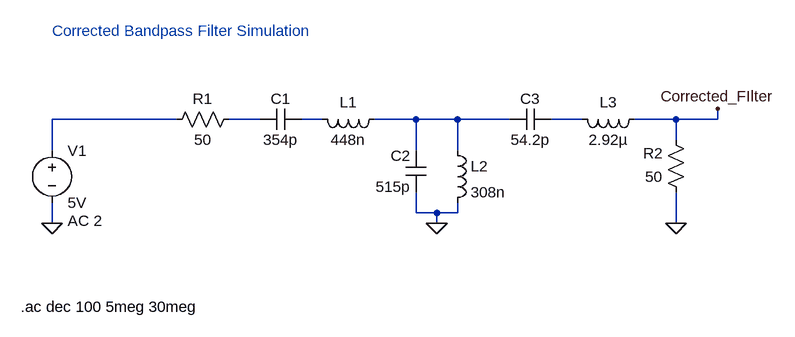
[diagram p0: schematic CorrectedBandPassSimulation.asc]
CorrectedBandPassSimulation.asc, the LTspice schematic file:
Version 4
SHEET 1 1152 680
WIRE 208 64 16 64
WIRE 336 64 288 64
WIRE 432 64 400 64
WIRE 576 64 512 64
WIRE 640 64 576 64
WIRE 720 64 640 64
WIRE 832 64 784 64
WIRE 976 64 912 64
WIRE 1040 64 1040 48
WIRE 1040 64 976 64
WIRE 976 96 976 64
WIRE 16 112 16 64
WIRE 576 112 576 64
WIRE 640 112 640 64
WIRE 576 208 576 176
WIRE 608 208 576 208
WIRE 640 208 640 192
WIRE 640 208 608 208
WIRE 16 224 16 192
WIRE 608 224 608 208
WIRE 976 224 976 176
FLAG 16 224 0
FLAG 976 224 0
FLAG 608 224 0
FLAG 1040 48 Corrected_FIlter
SYMBOL res 304 48 R90
WINDOW 0 0 56 VBottom 2
WINDOW 3 32 56 VTop 2
SYMATTR InstName R1
SYMATTR Value 50
SYMBOL res 992 192 R180
WINDOW 0 36 76 Left 2
WINDOW 3 36 40 Left 2
SYMATTR InstName R2
SYMATTR Value 50
SYMBOL voltage 16 96 R0
WINDOW 123 24 124 Left 2
WINDOW 39 0 0 Left 0
SYMATTR Value2 AC 2
SYMATTR InstName V1
SYMATTR Value 5V
SYMBOL cap 400 48 R90
WINDOW 0 0 32 VBottom 2
WINDOW 3 32 32 VTop 2
SYMATTR InstName C1
SYMATTR Value 354p
SYMBOL cap 592 176 R180
WINDOW 0 24 56 Left 2
WINDOW 3 24 8 Left 2
SYMATTR InstName C2
SYMATTR Value 515p
SYMBOL ind 528 48 R90
WINDOW 0 5 56 VBottom 2
WINDOW 3 32 56 VTop 2
SYMATTR InstName L1
SYMATTR Value 448n
SYMBOL ind 624 96 R0
SYMATTR InstName L2
SYMATTR Value 308n
SYMBOL ind 928 48 R90
WINDOW 0 5 56 VBottom 2
WINDOW 3 32 56 VTop 2
SYMATTR InstName L3
SYMATTR Value 2.92µ
SYMBOL cap 784 48 R90
WINDOW 0 0 32 VBottom 2
WINDOW 3 32 32 VTop 2
SYMATTR InstName C3
SYMATTR Value 54.2p
TEXT -32 352 Left 2 !.ac dec 100 5meg 30meg
TEXT 16 -72 Left 2 ;Corrected Bandpass Filter Simulation

The netlist it stands for:
* CorrectedBandPassSimulation.asc
R1 N002 N001 50
R2 0 Corrected_FIlter 50
V1 N001 0 5V AC 2
C1 N003 N002 354p
C2 0 N004 515p
L1 N004 N003 448n
L2 N004 0 308n
L3 Corrected_FIlter N005 2.92µ
C3 N005 N004 54.2p
.ac dec 100 5meg 30meg
* Corrected Bandpass Filter Simulation
.backanno
.end